# Altium schematic sheet Interface_Mikrobus.SchDoc: TITRE
size Letter; ApprovedBy: APPROUVÉ PAR; Organization: Cegep Limoilou; Address1: 1300, 8e Avenue; Address2: Québec, QC; Address3: Canada; Address4: G1J 5L5; SheetNumber: 3; SheetTotal: 4
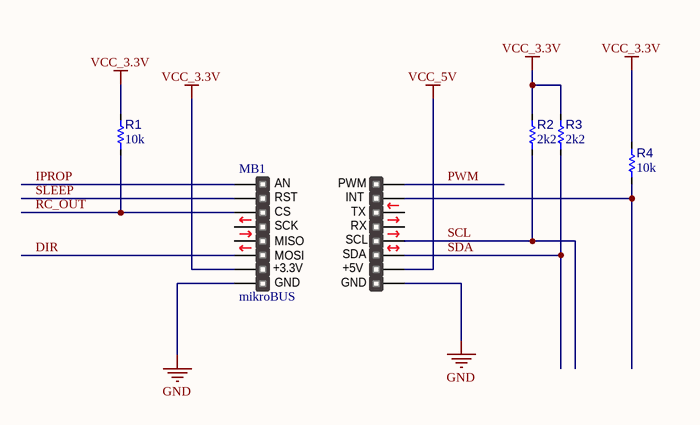
[diagram p0: Interface_Mikrobus.SchDoc]

## Parts
MB1  mikroBUS  [mikroBUS - Large]  (no BOM)
R1  value 10k  [R_1005[0402]]  (hidden comment: Res 10k 1% 0402)
R2  value 2k2  [R_1005[0402]]  (hidden comment: Res 2k2 1% 0402)
R3  value 2k2  [R_1005[0402]]  (hidden comment: Res 2k2 1% 0402)
R4  value 10k  [R_1005[0402]]  (hidden comment: Res 10k 1% 0402)

## Nets
GND: MB1.8(GND) MB1.9(GND)
VCC_3.3V: MB1.7(3.3V) R1.2 R2.2 R3.2 R4.2
VCC_5V: MB1.10(5V)
DIR: MB1.6(MOSI)
IPROP: MB1.1(AN)
PWM: MB1.16(PWM)
RC_OUT: MB1.3(CS) R1.1
SCL: MB1.12(SCL) R2.1
SDA: MB1.11(SDA) R3.1
SLEEP: MB1.2(RST)
NetMB1_15: MB1.15(INT) R4.1

Not connected (* = marked no-connect by the designer): MB1 4(SCK) 5(MISO) 13(TX) 14(RX)

## Notes on the sheet
- Titre :
- Conception :
- Date :
- Approbation :
- Heure :
- Révision :
- Feuille
- de
- Fichier :
- (in symbol mikroBUS compatible add-on board) +3.3V; +5V

## Library data of the parts
MB1 = mikroBUS compatible add-on board
R1 R4 = RES003: Resistor type 1; Manufacturer 1: Yageo; Manufacturer Part Number 1: RC0402FR-0710KL; LibRef: RES003; Puissance: 1/16W; Max Working Voltage: 50V; Tolerance: 1%; Mounting Technology: SMT; Supplier 1: LCSC; Supplier Part Number 1: C60490
R2 R3 = RES008: Resistor type 1; Manufacturer 1: Yageo; Manufacturer Part Number 1: RC0402FR-072K2L; LibRef: RES008; Code CEGEP: RES2.2KSM; Puissance: 1/16W; Max Working Voltage: 50V; Tolerance: 1%; Mounting Technology: SMT; Supplier 1: LCSC; Supplier Part Number 1: C114762; Supplier 2: Digi-Key; Supplier Part Number 2: 311-2.20KLRCT-ND